# EAGLE design mp3thing_simple1 (EAGLE 6.5.0)
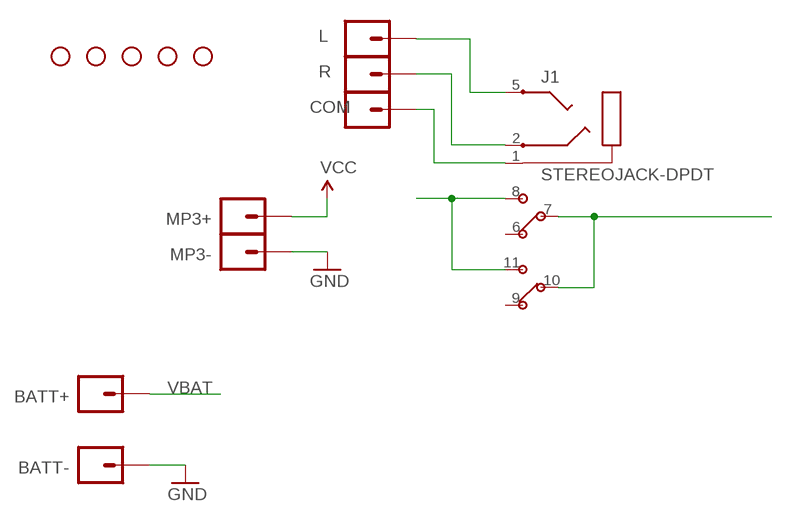
[diagram p0: schematic, sheet 1]

## Parts
BATT+  M01PTH  [1X01]
BATT-  M01PTH  [1X01]
COM  M01PTH  [1X01]
J1  STEREOJACK-DPDT  [STX3100-9C]
JP1  STAND-OFF  [STAND-OFF]
JP2  STAND-OFF  [STAND-OFF]
JP3  STAND-OFF  [STAND-OFF]
JP4  STAND-OFF  [STAND-OFF]
JP5  STAND-OFF  [STAND-OFF]
L  M01PTH  [1X01]
MP3+  M01PTH  [1X01]
MP3-  M01PTH  [1X01]
R  M01PTH  [1X01]

## Nets
GND: BATT-.1 MP3-.1
N$1: COM.1 J1.1
N$7: J1.5 L.1
N$8: J1.2 R.1
VBAT: BATT+.1 J1.7 J1.10
VCC: J1.8 J1.11 MP3+.1
Unconnected: J1.6 J1.9

## Library data of the parts
BATT+ BATT- COM L MP3+ MP3- R = SparkFun-20110517:M01: Header 1 Standard 1-pin 0.1" header. Use with straight break away headers (SKU : PRT-00116), right angle break away headers (PRT-00553), swiss pins (PRT-00743), machine pins (PRT-00117), and female headers (PRT-00115).
J1 = todstuff:STEREOJACK-DPDT
JP1-JP5 = SparkFun-20110517:STAND-OFF: Stand Off This is the mechanical footprint for a #4 phillips button head screw. Use the keepout ring to avoid running the screw head into surrounding components. SKU : PRT-00447

## Board
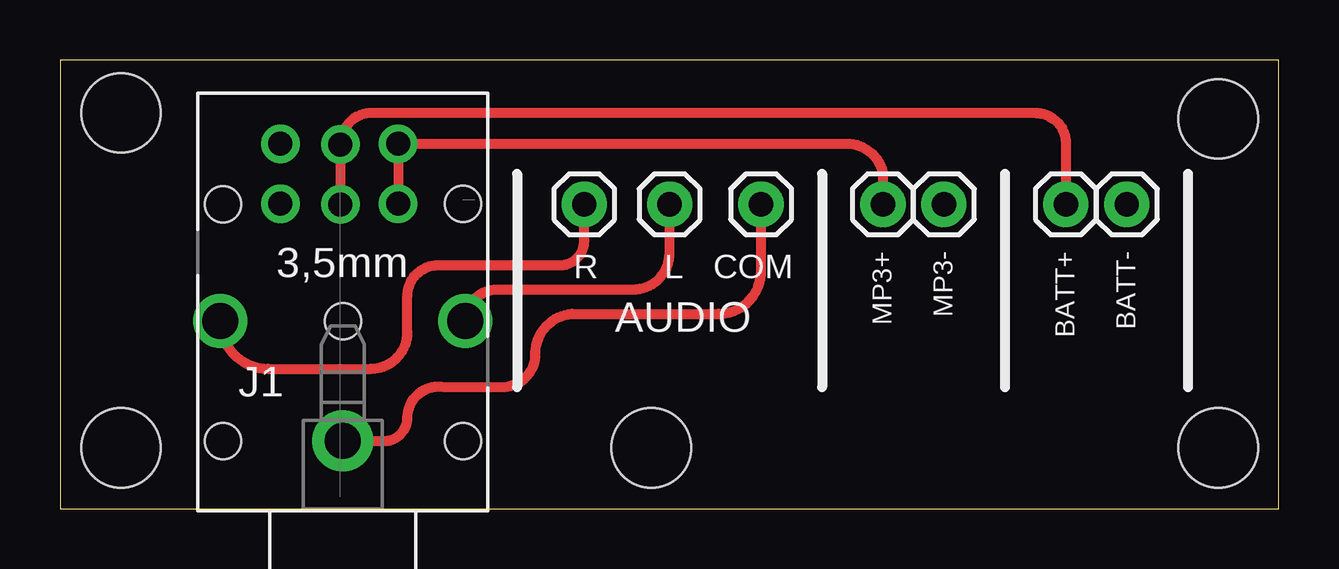
[diagram p1: board, top side]
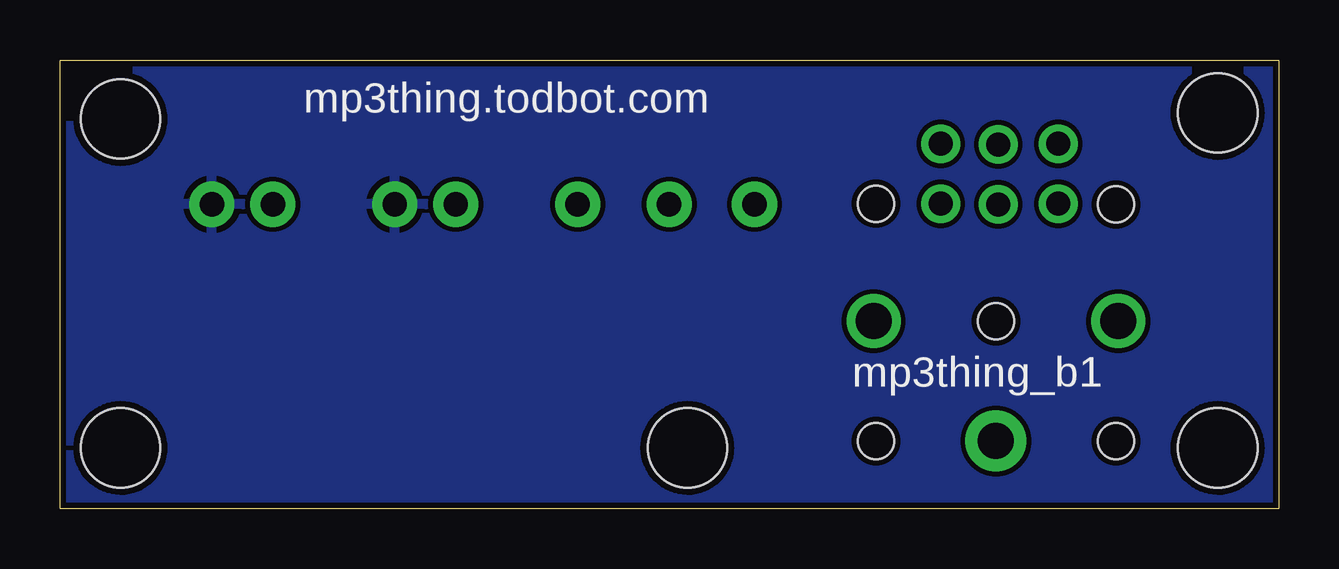
[diagram p2: board, bottom side, seen from below]

Size 50.78 x 18.72 mm. Coordinates in mm from the lower left corner, seen from the top.
Outline: 0,0 50.78,0 50.78,18.72 0,18.72 0,0
Copper layers (1*16): Top 0.035mm / dielectric 1.5mm / Bottom 0.035mm
Design rules "SparkFun *": minimum track width 10mil, minimum drill 20mil, track to track 8mil, track to pad 8mil, pad to pad 8mil, via to via 8mil, smd to smd 8mil, copper to edge 10mil, drill to drill 8mil, minimum pad ring 12mil, minimum via ring 10mil, stop-mask expansion 4mil, vias tented up to drill 25mil, thermal gap 10mil

### Footprints (pad centres in the part's own frame; a part is rotated, then mirrored left to right if it is on the bottom)
1X01 = drill 1.016 pad 1.88: 1 0,0
STX3100-9C = drill 1.5 pad 2.54: 1 1.43,-0.1 | drill 1.5: 2 6.43,5; 5 6.43,-5.2 | drill 1: 6 11.33,2.5; 7 11.3,0; 8 11.33,-2.4; 9 13.83,2.5; 10 13.8,0; 11 13.83,-2.4 | hole 1.5: 1.43,4.9; 1.43,-5.1; 6.43,-0.1; 11.295,4.9; 11.33,-5.1
STAND-OFF = hole 3.302: 0,0

### Placement (x,y rotation side)
BATT+  41.91,12.7 0 top
BATT-  44.45,12.7 0 top
COM  29.21,12.7 0 top
J1  11.68,1.4 90 top
JP1  24.64,2.54 0 top
JP2  48.26,16.26 0 top
JP3  48.26,2.54 0 top
JP4  2.54,2.54 0 top
JP5  2.54,16.51 0 top
L  25.4,12.7 0 top
MP3+  34.29,12.7 0 top
MP3-  36.83,12.7 0 top
R  21.84,12.7 0 top

### Tracks (layer width: path | path; a pad name or v marks a point on that pad's centre or on a via)
GND
  pour Bottom: 0,22.86 0,-1.27 53.34,-1.27 52.07,22.86
N$1
  Top 0.406: J1.1 13.49,2.83 arc90 14.48,3.81 arc-100 16,5.08 18.29,5.08 arc90 19.81,6.35 arc-90 21.34,8.13 27.43,8.13 arc90 29.21,9.91 29.21,10.67 COM.1
N$7
  Top 0.406: J1.5 arc-90 18.2,9.14 22.1,9.14 23.88,9.14 arc90 25.4,10.67 L.1
N$8
  Top 0.406: J1.2 arc90 8.67,5.84 12.95,5.84 arc90 14.48,7.37 14.48,8.89 arc-90 15.75,10.16 19.05,10.16 20.83,10.16 arc90 21.84,11.18 R.1
VBAT
  Top 0.406: J1.7 J1.10 arc-90 13,16.51 15.24,16.51 40.64,16.51 arc-90 41.91,15.24 BATT+.1
VCC
  Top 0.406: J1.8 J1.11 32.78,15.23 arc-80 34.29,13.97 MP3+.1

### Text on the board
tPlace: AUDIO
bPlace: mp3thing.todbot.com | mp3thing_b1